# EAGLE design M709X (EAGLE 6.6.0)
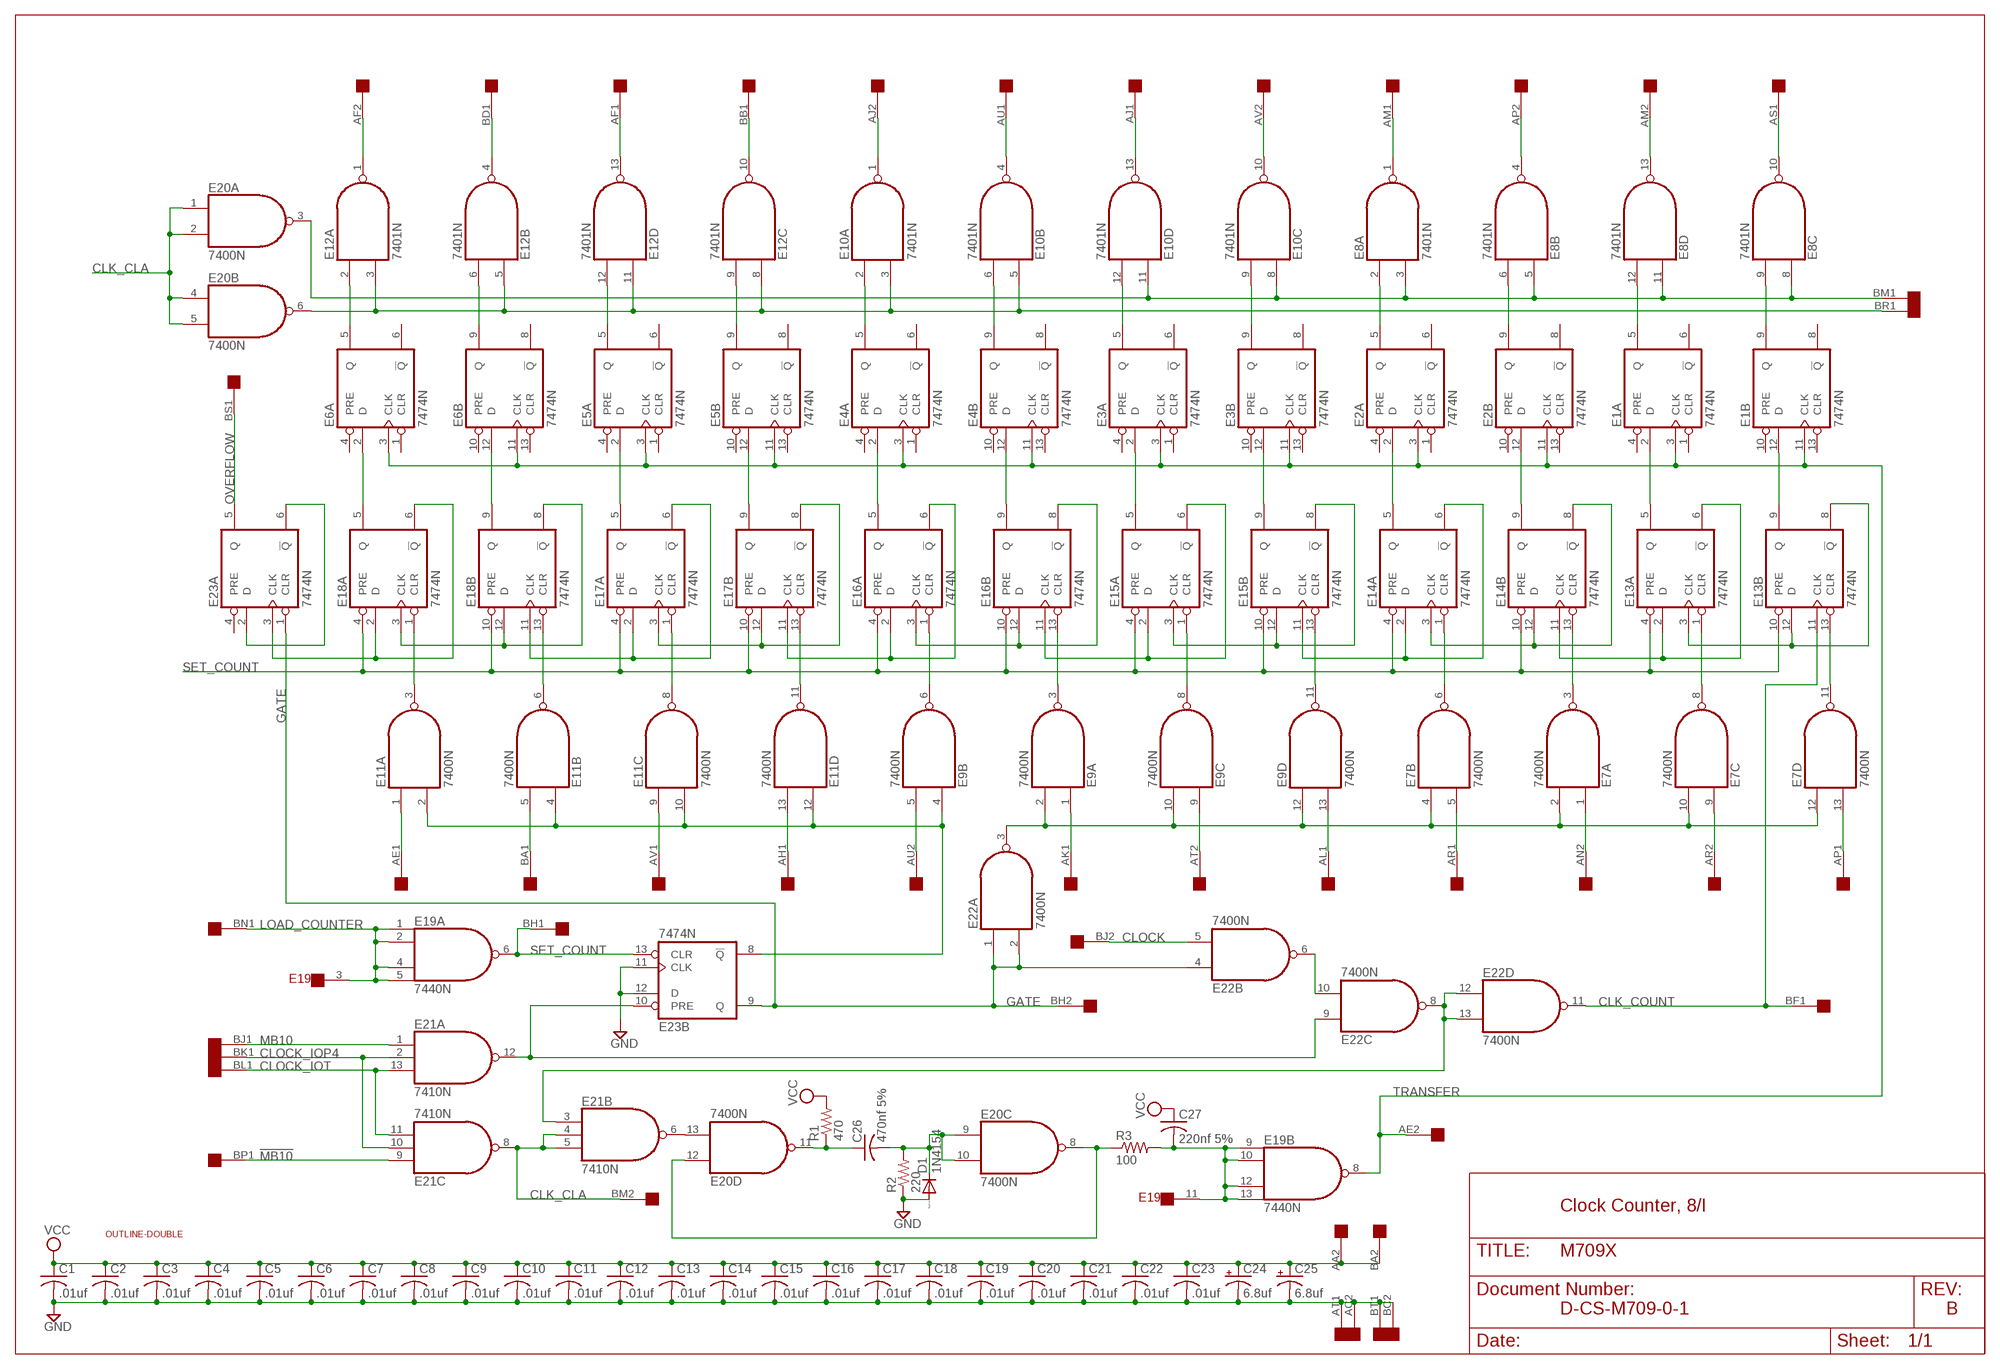
[diagram p0: schematic, sheet 1]

## Parts
C1  .01uf  C-US075-032X103  [C075-032X103]
C2  .01uf  C-US075-032X103  [C075-032X103]
C3  .01uf  C-US075-032X103  [C075-032X103]
C4  .01uf  C-US075-032X103  [C075-032X103]
C5  .01uf  C-US075-032X103  [C075-032X103]
C6  .01uf  C-US075-032X103  [C075-032X103]
C7  .01uf  C-US075-032X103  [C075-032X103]
C8  .01uf  C-US075-032X103  [C075-032X103]
C9  .01uf  C-US075-032X103  [C075-032X103]
C10  .01uf  C-US075-032X103  [C075-032X103]
C11  .01uf  C-US075-032X103  [C075-032X103]
C12  .01uf  C-US075-032X103  [C075-032X103]
C13  .01uf  C-US075-032X103  [C075-032X103]
C14  .01uf  C-US075-032X103  [C075-032X103]
C15  .01uf  C-US075-032X103  [C075-032X103]
C16  .01uf  C-US075-032X103  [C075-032X103]
C17  .01uf  C-US075-032X103  [C075-032X103]
C18  .01uf  C-US075-032X103  [C075-032X103]
C19  .01uf  C-US075-032X103  [C075-032X103]
C20  .01uf  C-US075-032X103  [C075-032X103]
C21  .01uf  C-US075-032X103  [C075-032X103]
C22  .01uf  C-US075-032X103  [C075-032X103]
C23  .01uf  C-US075-032X103  [C075-032X103]
C24  6.8uf  CPOL-USE15-5AXIAL  [E15-5]
C25  6.8uf  CPOL-USE15-5AXIAL  [E15-5]
C26  470nf 5%  C-US075-032X103  [C075-032X103]
C27  220nf 5%  C-US075-032X103  [C075-032X103]
D1  1N4154  DIODE-SOD61B  [SOD61B]
E1  7474N  74S74N  [DIL14]
E2  7474N  74S74N  [DIL14]
E3  7474N  74S74N  [DIL14]
E4  7474N  74S74N  [DIL14]
E5  7474N  74S74N  [DIL14]
E6  7474N  74S74N  [DIL14]
E7  7400N  [DIL14]
E8  7401N  74LS01N  [DIL14]
E9  7400N  [DIL14]
E10  7401N  74LS01N  [DIL14]
E11  7400N  [DIL14]
E12  7401N  74LS01N  [DIL14]
E13  7474N  74S74N  [DIL14]
E14  7474N  74S74N  [DIL14]
E15  7474N  74S74N  [DIL14]
E16  7474N  74S74N  [DIL14]
E17  7474N  74S74N  [DIL14]
E18  7474N  74S74N  [DIL14]
E19  7440N  74S40N  [DIL14]
E20  7400N  [DIL14]
E21  7410N  [DIL14]
E22  7400N  [DIL14]
E23  7474N  74S74N  [DIL14]
R1  470  R-US_0207/15  [0207/15]
R2  220  R-US_0207/15  [0207/15]
R3  100  R-US_0207/15  [0207/15]
U$1  OUTLINE-DOUBLE  [DOUBLE]
U$2  DOUBLE  [EDGE-CON4]

## Nets
!MB10: E21.9(C:I0) U$2.BP1
CLK_CLA: E20.1(A:I0) E20.2(A:I1) E20.4(B:I0) E20.5(B:I1) E21.4(B:I1) E21.5(B:I2) E21.8(C:O) U$2.BM2
CLK_COUNT: E13.11(B:CLK) E22.11(D:O) U$2.BF1
CLOCK: E22.5(B:I1) U$2.BJ2
CLOCK_IOP4: E21.2(A:I1) E21.10(C:I1) U$2.BK1
CLOCK_IOT: E21.11(C:I2) E21.13(A:I2) U$2.BL1
GATE: E22.1(A:I0) E22.2(A:I1) E22.4(B:I0) E23.1(A:CLR) E23.9(B:Q) U$2.BH2
GND [Supply]: C1.2 C2.2 C3.2 C4.2 C5.2 C6.2 C7.2 C8.2 C9.2 C10.2 C11.2 C12.2 C13.2 C14.2 C15.2 C16.2 C17.2 C18.2 C19.2 C20.2 C21.2 C22.2 C23.2 C24.- C25.- D1.A E23.11(B:CLK) E23.12(B:D) R2.1 U$2.AC2 U$2.AT1 U$2.BC2 U$2.BT1
LOAD_COUNTER: E19.1(A:I0) E19.2(A:I1) E19.3(3:NC) E19.4(A:I2) E19.5(A:I3) U$2.BN1
MB10: E21.1(A:I0) U$2.BJ1
N$1: E1.9(B:Q) E8.9(C:I1)
N$2: E1.5(A:Q) E8.12(D:I1)
N$3: E2.9(B:Q) E8.6(B:I1)
N$4: E2.5(A:Q) E8.2(A:I0)
N$5: E6.5(A:Q) E12.2(A:I0)
N$6: E3.9(B:Q) E10.9(C:I1)
N$7: E3.5(A:Q) E10.12(D:I1)
N$8: E4.5(A:Q) E10.2(A:I0)
N$9: E4.9(B:Q) E10.6(B:I1)
N$10: E5.5(A:Q) E12.12(D:I1)
N$11: E5.9(B:Q) E12.9(C:I1)
N$12: E6.9(B:Q) E12.6(B:I1)
N$13: E10.3(A:I1) E10.5(B:I0) E12.3(A:I1) E12.5(B:I0) E12.8(C:I0) E12.11(D:I0) E20.6(B:O) U$2.BR1
N$14: E8.1(A:O) U$2.AM1
N$15: E8.4(B:O) U$2.AP2
N$16: E8.13(D:O) U$2.AM2
N$17: E8.10(C:O) U$2.AS1
N$18: E10.13(D:O) U$2.AJ1
N$19: E10.4(B:O) U$2.AU1
N$20: E10.1(A:O) U$2.AJ2
N$21: E10.10(C:O) U$2.AV2
N$22: E12.1(A:O) U$2.AF2
N$23: E12.4(B:O) U$2.BD1
N$24: E12.13(D:O) U$2.AF1
N$25: E12.10(C:O) U$2.BB1
N$27: E8.3(A:I1) E8.5(B:I0) E8.8(C:I0) E8.11(D:I0) E10.8(C:I0) E10.11(D:I0) E20.3(A:O) U$2.BM1
N$28: E6.2(A:D) E18.5(A:Q)
N$29: E6.12(B:D) E18.9(B:Q)
N$30: E5.2(A:D) E17.5(A:Q)
N$31: E5.12(B:D) E17.9(B:Q)
N$32: E4.2(A:D) E16.5(A:Q)
N$33: E4.12(B:D) E16.9(B:Q)
N$34: E3.2(A:D) E15.5(A:Q)
N$35: E3.12(B:D) E15.9(B:Q)
N$36: E2.2(A:D) E14.5(A:Q)
N$37: E2.12(B:D) E14.9(B:Q)
N$38: E1.2(A:D) E13.5(A:Q)
N$39: E1.12(B:D) E13.9(B:Q)
N$40: E13.3(A:CLK) E13.8(B:!Q) E13.12(B:D)
N$41: E13.2(A:D) E13.6(A:!Q) E14.11(B:CLK)
N$42: E14.3(A:CLK) E14.8(B:!Q) E14.12(B:D)
N$43: E14.2(A:D) E14.6(A:!Q) E15.11(B:CLK)
N$44: E15.3(A:CLK) E15.8(B:!Q) E15.12(B:D)
N$45: E15.2(A:D) E15.6(A:!Q) E16.11(B:CLK)
N$46: E16.3(A:CLK) E16.8(B:!Q) E16.12(B:D)
N$47: E16.2(A:D) E16.6(A:!Q) E17.11(B:CLK)
N$48: E17.3(A:CLK) E17.8(B:!Q) E17.12(B:D)
N$49: E17.2(A:D) E17.6(A:!Q) E18.11(B:CLK)
N$50: E18.3(A:CLK) E18.8(B:!Q) E18.12(B:D)
N$51: E18.2(A:D) E18.6(A:!Q) E23.3(A:CLK)
N$52: E23.2(A:D) E23.6(A:!Q)
N$53: E7.6(B:O) E14.1(A:CLR)
N$54: E7.3(A:O) E14.13(B:CLR)
N$55: E7.8(C:O) E13.1(A:CLR)
N$56: E7.11(D:O) E13.13(B:CLR)
N$57: E7.2(A:I1) E7.4(B:I0) E7.10(C:I1) E7.12(D:I0) E9.2(A:I1) E9.10(C:I1) E9.12(D:I0) E22.3(A:O)
N$58: E9.4(B:I0) E11.2(A:I1) E11.4(B:I0) E11.10(C:I1) E11.12(D:I0) E23.8(B:!Q)
N$59: E22.6(B:O) E22.10(C:I1)
N$60: E7.13(D:I1) U$2.AP1
N$61: E9.6(B:O) E16.1(A:CLR)
N$62: E9.3(A:O) E16.13(B:CLR)
N$63: E9.8(C:O) E15.1(A:CLR)
N$64: E9.11(D:O) E15.13(B:CLR)
N$65: E11.11(D:O) E17.13(B:CLR)
N$66: E11.8(C:O) E17.1(A:CLR)
N$67: E11.6(B:O) E18.13(B:CLR)
N$68: E11.3(A:O) E18.1(A:CLR)
N$69: E7.9(C:I0) U$2.AR2
N$70: E7.1(A:I0) U$2.AN2
N$71: E7.5(B:I1) U$2.AR1
N$72: E9.13(D:I1) U$2.AL1
N$73: E9.1(A:I0) U$2.AK1
N$74: E9.9(C:I0) U$2.AT2
N$75: E11.9(C:I0) U$2.AV1
N$76: E11.13(D:I1) U$2.AH1
N$77: E9.5(B:I1) U$2.AU2
N$78: E11.1(A:I0) U$2.AE1
N$79: E11.5(B:I1) U$2.BA1
N$81: E21.12(A:O) E22.9(C:I0) E23.10(B:PRE)
N$83: E21.3(B:I0) E22.8(C:O) E22.12(D:I0) E22.13(D:I1)
N$84: C26.2 D1.C E20.9(C:I0) E20.10(C:I1) R2.2
N$85: E20.13(D:I1) E21.6(B:O)
N$86: C27.2 E19.9(B:I0) E19.10(B:I1) E19.11(11:NC) E19.12(B:I2) E19.13(B:I3) R3.2
N$87: C26.1 E20.11(D:O) R1.1
N$89: E20.8(C:O) E20.12(D:I0) R3.1
OVERFLOW: E23.5(A:Q) U$2.BS1
SET_COUNT: E13.4(A:PRE) E13.10(B:PRE) E14.4(A:PRE) E14.10(B:PRE) E15.4(A:PRE) E15.10(B:PRE) E16.4(A:PRE) E16.10(B:PRE) E17.4(A:PRE) E17.10(B:PRE) E18.4(A:PRE) E18.10(B:PRE) E19.6(A:O) E23.13(B:CLR) U$2.BH1
TRANSFER: E1.3(A:CLK) E1.11(B:CLK) E2.3(A:CLK) E2.11(B:CLK) E3.3(A:CLK) E3.11(B:CLK) E4.3(A:CLK) E4.11(B:CLK) E5.3(A:CLK) E5.11(B:CLK) E6.3(A:CLK) E6.11(B:CLK) E19.8(B:O) U$2.AE2
VCC [Supply]: C1.1 C2.1 C3.1 C4.1 C5.1 C6.1 C7.1 C8.1 C9.1 C10.1 C11.1 C12.1 C13.1 C14.1 C15.1 C16.1 C17.1 C18.1 C19.1 C20.1 C21.1 C22.1 C23.1 C24.+ C25.+ C27.1 R1.2 U$2.AA2 U$2.BA2
Unconnected: E1.1(A:CLR) E1.4(A:PRE) E1.6(A:!Q) E1.8(B:!Q) E1.10(B:PRE) E1.13(B:CLR) E2.1(A:CLR) E2.4(A:PRE) E2.6(A:!Q) E2.8(B:!Q) E2.10(B:PRE) E2.13(B:CLR) E3.1(A:CLR) E3.4(A:PRE) E3.6(A:!Q) E3.8(B:!Q) E3.10(B:PRE) E3.13(B:CLR) E4.1(A:CLR) E4.4(A:PRE) E4.6(A:!Q) E4.8(B:!Q) E4.10(B:PRE) E4.13(B:CLR) E5.1(A:CLR) E5.4(A:PRE) E5.6(A:!Q) E5.8(B:!Q) E5.10(B:PRE) E5.13(B:CLR) E6.1(A:CLR) E6.4(A:PRE) E6.6(A:!Q) E6.8(B:!Q) E6.10(B:PRE) E6.13(B:CLR) E23.4(A:PRE) U$2.AA1 U$2.AB1 U$2.AB2 U$2.AC1 U$2.AD1 U$2.AD2 U$2.AH2 U$2.AK2 U$2.AL2 U$2.AN1 U$2.AS2 U$2.BB2 U$2.BC1 U$2.BD2 U$2.BE1 U$2.BE2 U$2.BF2 U$2.BK2 U$2.BL2 U$2.BN2 U$2.BP2 U$2.BR2 U$2.BS2 U$2.BT2 U$2.BU1 U$2.BU2 U$2.BV1 U$2.BV2

## Notes on the sheet
- Clock Counter, 8/I
- D-CS-M709-0-1 | B

## Power pins joined to a net without a drawn wire
GND: E1.7(P:GND) E2.7(P:GND) E3.7(P:GND) E4.7(P:GND) E5.7(P:GND) E6.7(P:GND) E7.7(P:GND) E8.7(P:GND) E9.7(P:GND) E10.7(P:GND) E11.7(P:GND) E12.7(P:GND) E13.7(P:GND) E14.7(P:GND) E15.7(P:GND) E16.7(P:GND) E17.7(P:GND) E18.7(P:GND) E19.7(P:GND) E20.7(P:GND) E21.7(P:GND) E22.7(P:GND) E23.7(P:GND)
VCC: E1.14(P:VCC) E2.14(P:VCC) E3.14(P:VCC) E4.14(P:VCC) E5.14(P:VCC) E6.14(P:VCC) E7.14(P:VCC) E8.14(P:VCC) E9.14(P:VCC) E10.14(P:VCC) E11.14(P:VCC) E12.14(P:VCC) E13.14(P:VCC) E14.14(P:VCC) E15.14(P:VCC) E16.14(P:VCC) E17.14(P:VCC) E18.14(P:VCC) E19.14(P:VCC) E20.14(P:VCC) E21.14(P:VCC) E22.14(P:VCC) E23.14(P:VCC)

## Library data of the parts
C1-C23 C26 C27 = rcl:C-US: CAPACITOR, American symbol
C24 C25 = dec-con:CPOL-USE15-5AXIAL: 0.6" veresion of an electrolytic
D1 = diode:DIODE-: DIODE
E1-E6 E13-E18 E23 = 74xx-us:74*74: Dual D type positive edge triggered FLIP FLOP, preset and clear
E7 E9 E11 E20 E22 = 74xx-us:74*00: Quad 2-input NAND gate
E8 E10 E12 = 74xx-us:74*01: Quad 2-input NAND gate, open collector
E19 = dec-con:74*40: Dual 4-input NAND gate
E21 = 74xx-us:74*10: Triple 3-input NAND gate
R1-R3 = rcl:R-US_: RESISTOR, American symbol
U$1 = dec-con:OUTLINE-*: Board outlines for DEC boards.
U$2 = dec-con:DOUBLE: Double-Height DEC board

## Net classes
0 default: width 0.406 mm
1 Supply: width 0.813 mm

## Board
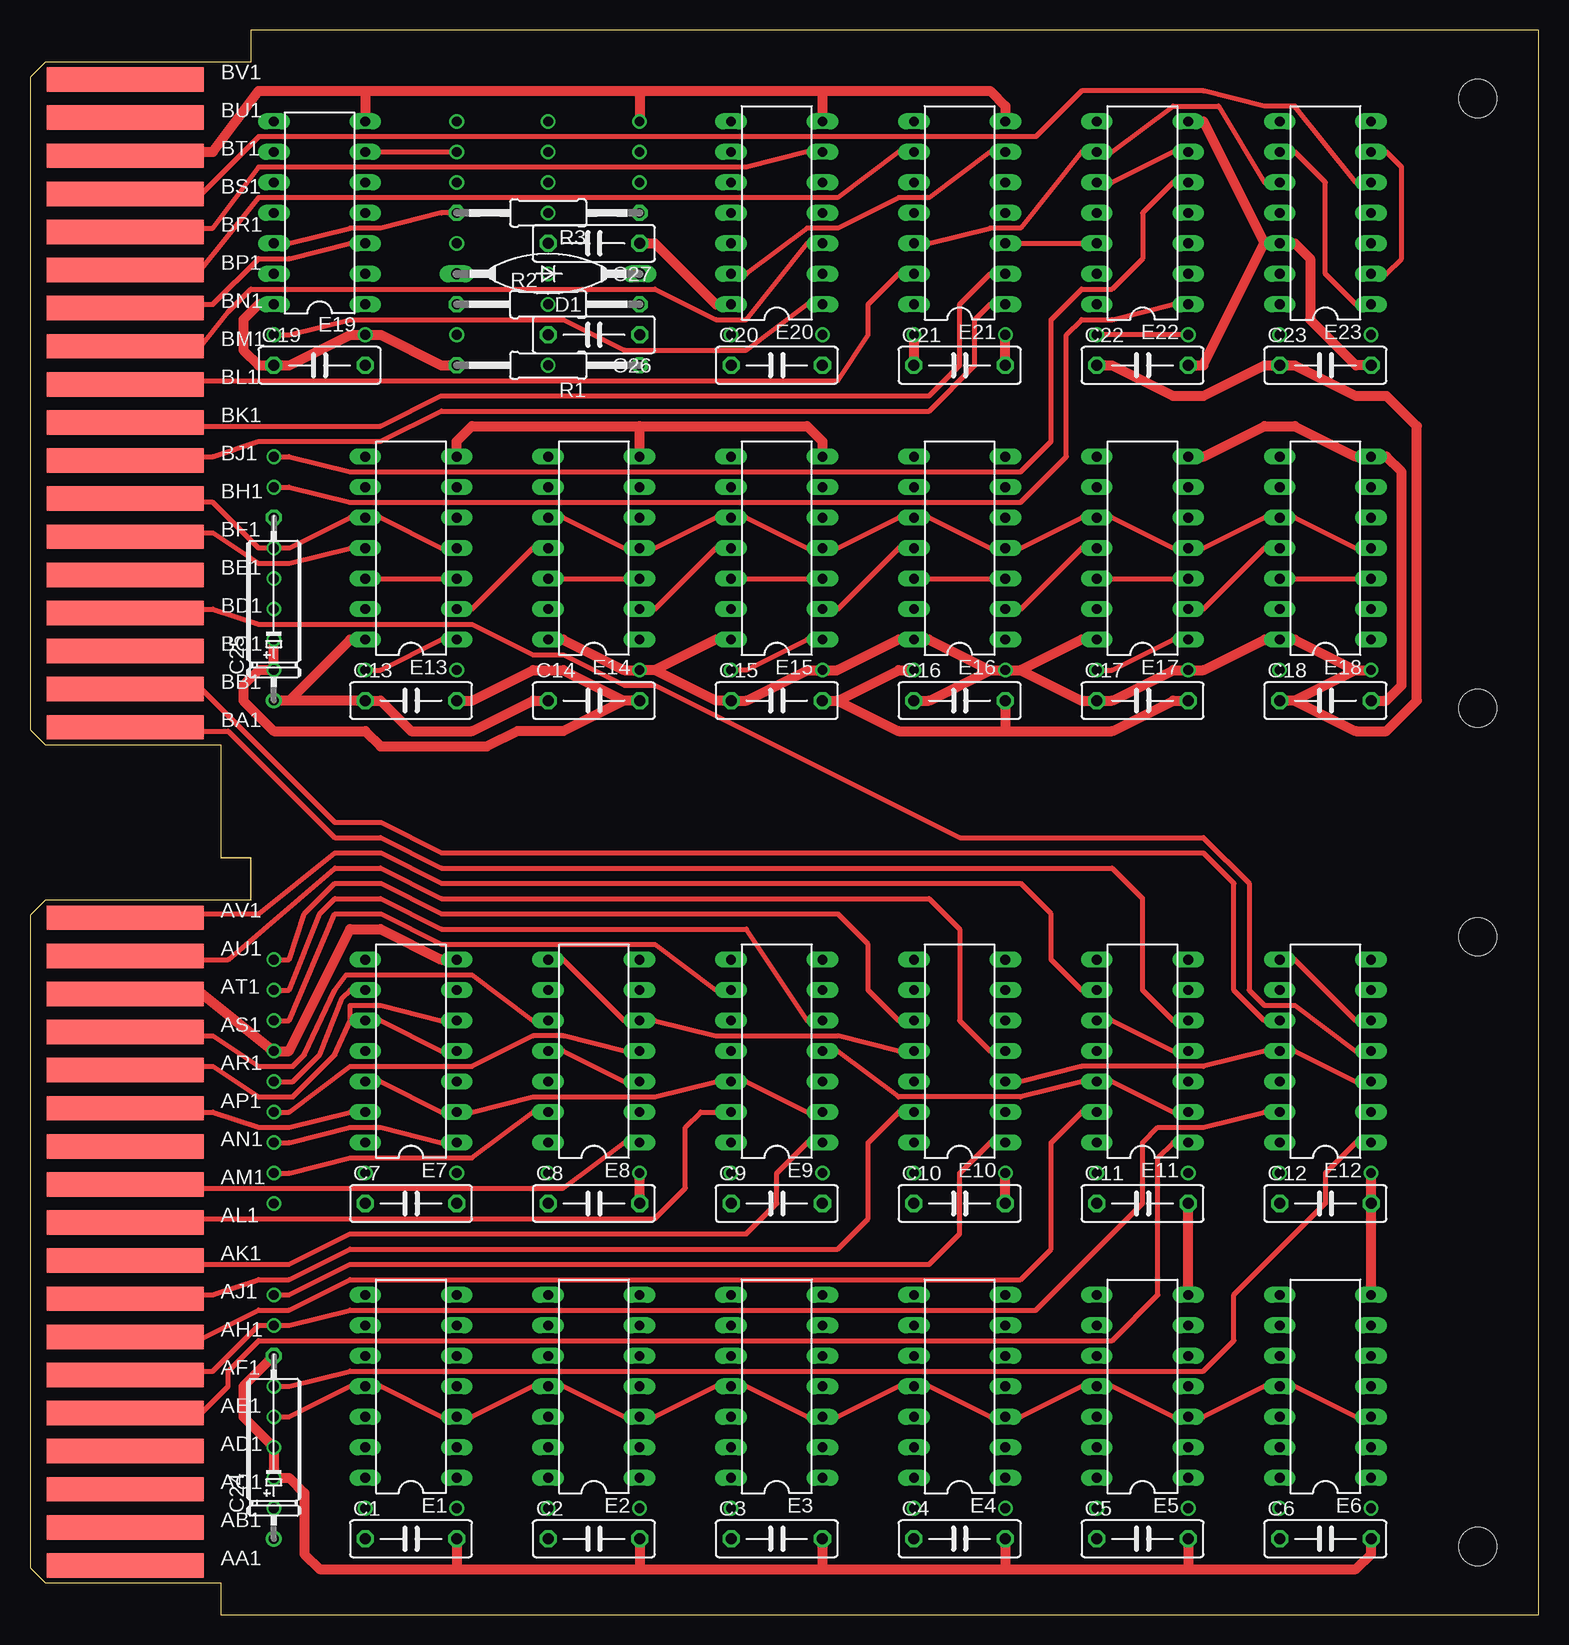
[diagram p1: board, top side]
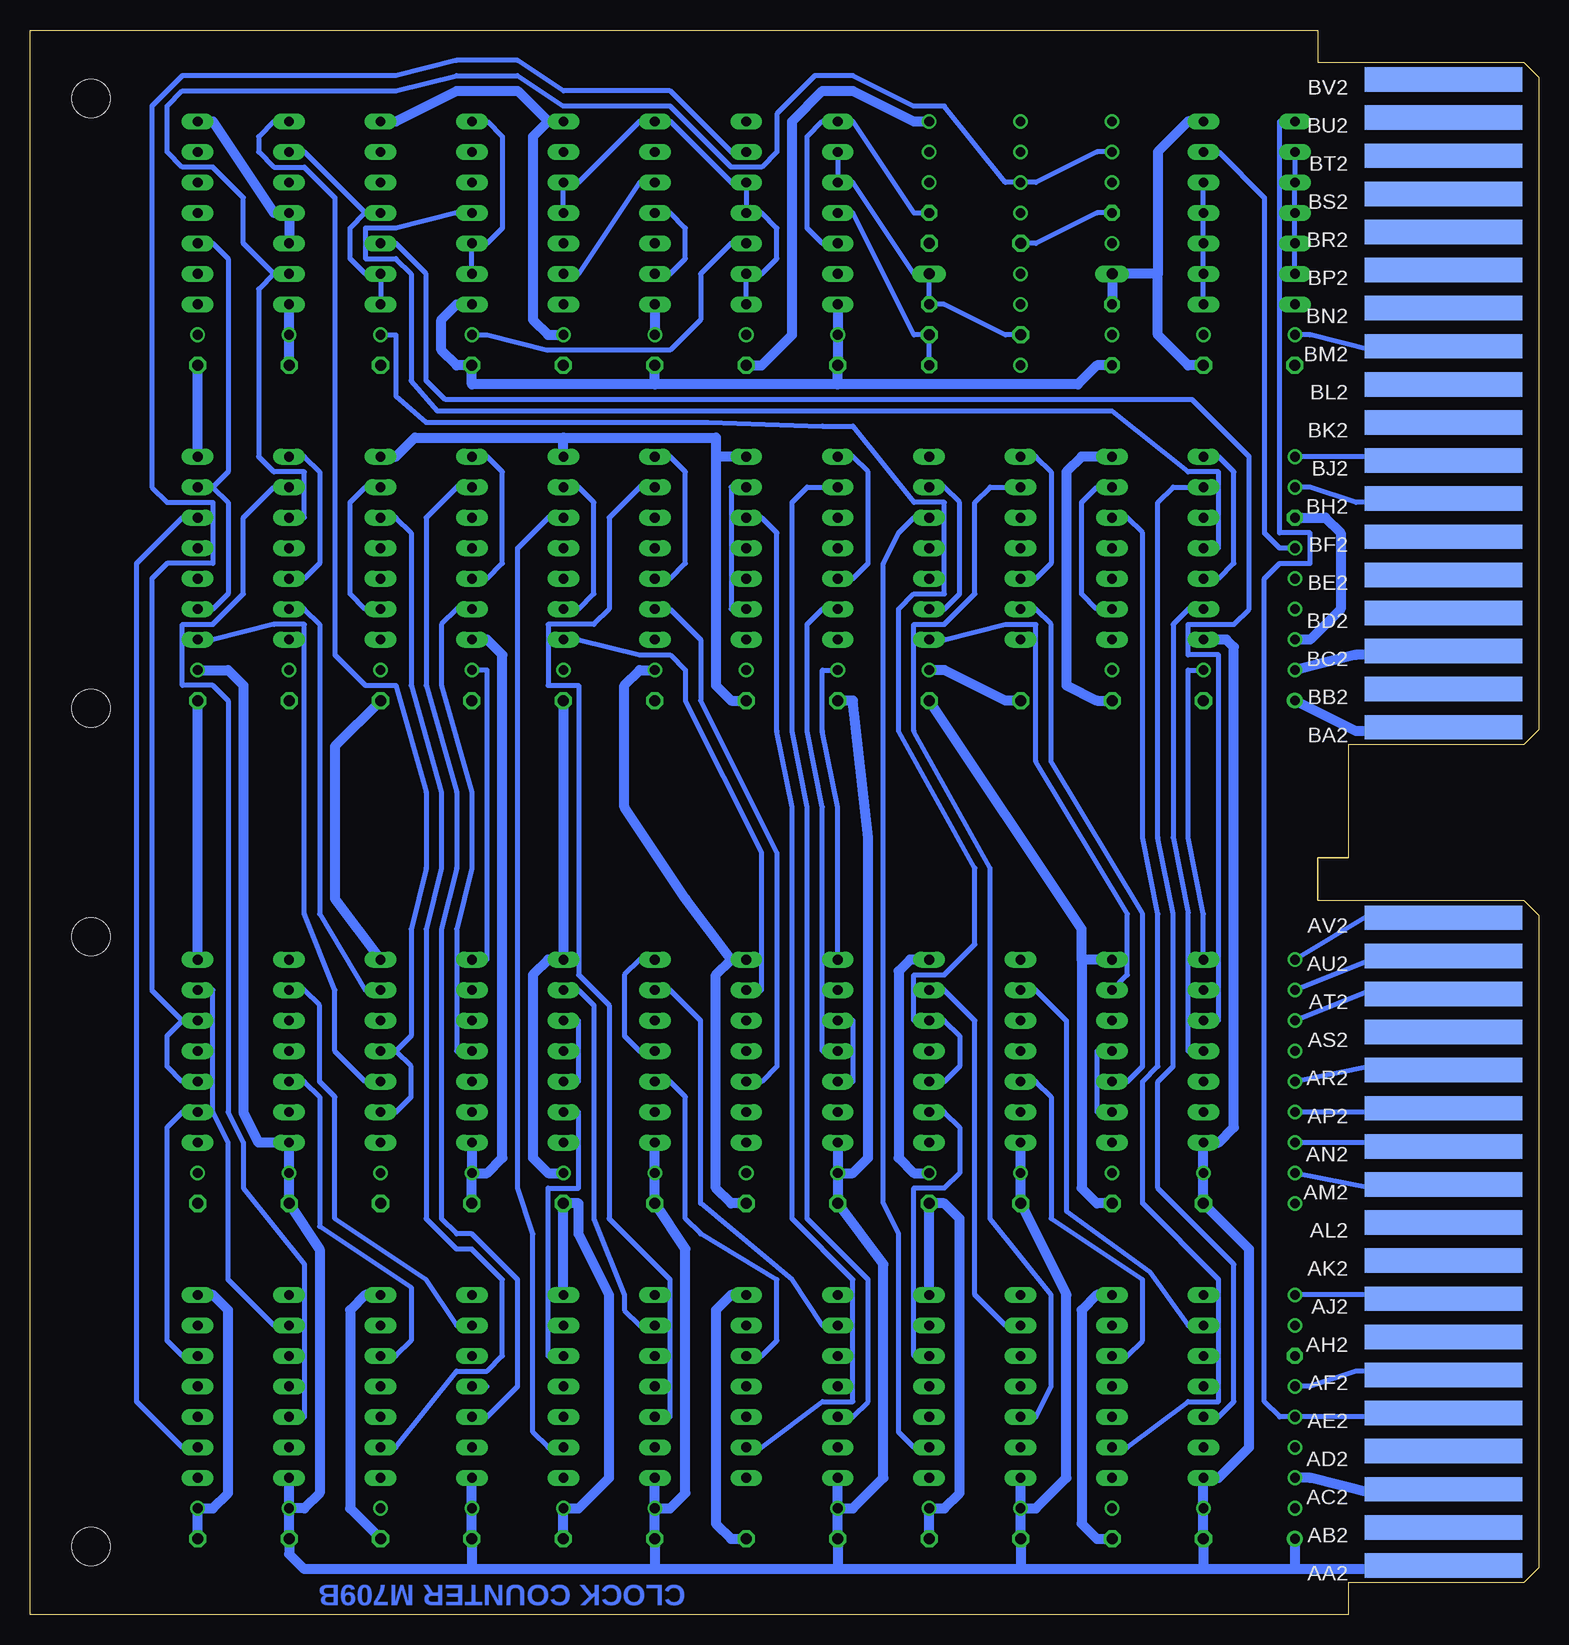
[diagram p2: board, bottom side, seen from below]

Size 125.73 x 132.08 mm. Coordinates in mm from the lower left corner, seen from the top.
Copper layers (1+16): Top 0.035mm / dielectric 1.5mm / Bottom 0.035mm
Design rules "16mils": minimum track width 16mil, minimum drill 32mil, track to track 15mil, track to pad 10mil, pad to pad 10mil, via to via 10mil, smd to smd 10mil, copper to edge 13mil, drill to drill 10mil, minimum pad ring 10mil, minimum via ring 8mil, stop-mask expansion 0mil, vias tented up to drill 0mil, thermal gap 10mil

### Footprints (pad centres in the part's own frame; a part is rotated, then mirrored left to right if it is on the bottom)
C075-032X103 = drill 0.914 octagon: 1 -3.81,0; 2 3.81,0
E15-5 = drill 0.813: + -7.62,0 | drill 0.813 octagon: - 7.62,0
SOD61B = drill 0.914 long: A 7.62,0; C -7.62,0
DIL14 = drill 0.813 long: 1 -7.62,-3.81; 2 -5.08,-3.81; 3 -2.54,-3.81; 4 0,-3.81; 5 2.54,-3.81; 6 5.08,-3.81; 7 7.62,-3.81; 8 7.62,3.81; 9 5.08,3.81; 10 2.54,3.81; 11 0,3.81; 12 -2.54,3.81; 13 -5.08,3.81; 14 -7.62,3.81
0207/15 = drill 0.813 octagon: 1 -7.62,0; 2 7.62,0
DOUBLE = hole 3.175: 120.65,56.515; 120.65,5.715; 120.65,75.565; 120.65,126.365
EDGE-CON4 = smd 13.106 x 2.032: AA1 7.938,4.128; AB1 7.938,7.303; AC1 7.938,10.477; AD1 7.938,13.652; AE1 7.938,16.828; AF1 7.938,20.003; AH1 7.938,23.177; AJ1 7.938,26.352; AK1 7.938,29.527; AL1 7.938,32.703; AM1 7.938,35.877; AN1 7.938,39.053; AP1 7.938,42.227; AR1 7.938,45.403; AS1 7.938,48.578; AT1 7.938,51.752; AU1 7.938,54.928; AV1 7.938,58.102; BA1 7.938,73.978; BB1 7.938,77.153; BC1 7.938,80.328; BD1 7.938,83.502; BE1 7.938,86.677; BF1 7.938,89.853; BH1 7.938,93.028; BJ1 7.938,96.203; BK1 7.938,99.377; BL1 7.938,102.552; BM1 7.938,105.728; BN1 7.938,108.903; BP1 7.938,112.078; BR1 7.938,115.252; BS1 7.938,118.427; BT1 7.938,121.603; BU1 7.938,124.778; BV1 7.938,127.953 | smd 13.106 x 2.032 bottom: AA2 7.938,4.128; AB2 7.938,7.303; AC2 7.938,10.477; AD2 7.938,13.652; AE2 7.938,16.828; AF2 7.938,20.003; AH2 7.938,23.177; AJ2 7.938,26.352; AK2 7.938,29.527; AL2 7.938,32.703; AM2 7.938,35.877; AN2 7.938,39.053; AP2 7.938,42.227; AR2 7.938,45.403; AS2 7.938,48.578; AT2 7.938,51.752; AU2 7.938,54.928; AV2 7.938,58.102; BA2 7.938,73.978; BB2 7.938,77.153; BC2 7.938,80.328; BD2 7.938,83.502; BE2 7.938,86.677; BF2 7.938,89.853; BH2 7.938,93.028; BJ2 7.938,96.203; BK2 7.938,99.377; BL2 7.938,102.552; BM2 7.938,105.728; BN2 7.938,108.903; BP2 7.938,112.078; BR2 7.938,115.252; BS2 7.938,118.427; BT2 7.938,121.603; BU2 7.938,124.778; BV2 7.938,127.953

### Placement (x,y rotation side)
C1  31.75,6.35 0 top
C2  46.99,6.35 0 top
C3  62.23,6.35 0 top
C4  77.47,6.35 0 top
C5  92.71,6.35 0 top
C6  107.95,6.35 0 top
C7  31.75,34.29 0 top
C8  46.99,34.29 0 top
C9  62.23,34.29 0 top
C10  77.47,34.29 0 top
C11  92.71,34.29 0 top
C12  107.95,34.29 0 top
C13  31.75,76.2 0 top
C14  46.99,76.2 0 top
C15  62.23,76.2 0 top
C16  77.47,76.2 0 top
C17  92.71,76.2 0 top
C18  107.95,76.2 0 top
C19  24.13,104.14 0 top
C20  62.23,104.14 0 top
C21  77.47,104.14 0 top
C22  92.71,104.14 0 top
C23  107.95,104.14 0 top
C24  20.32,13.97 90 top
C25  20.32,83.82 90 top
C26  46.99,106.68 180 top
C27  46.99,114.3 180 top
D1  43.18,111.76 180 top
E1  31.75,19.05 90 top
E2  46.99,19.05 90 top
E3  62.23,19.05 90 top
E4  77.47,19.05 90 top
E5  92.71,19.05 90 top
E6  107.95,19.05 90 top
E7  31.75,46.99 90 top
E8  46.99,46.99 90 top
E9  62.23,46.99 90 top
E10  77.47,46.99 90 top
E11  92.71,46.99 90 top
E12  107.95,46.99 90 top
E13  31.75,88.9 90 top
E14  46.99,88.9 90 top
E15  62.23,88.9 90 top
E16  77.47,88.9 90 top
E17  92.71,88.9 90 top
E18  107.95,88.9 90 top
E19  24.13,116.84 90 top
E20  62.23,116.84 90 top
E21  77.47,116.84 90 top
E22  92.71,116.84 90 top
E23  107.95,116.84 90 top
R1  43.18,104.14 180 top
R2  43.18,109.22 0 top
R3  43.18,116.84 180 top
U$1  0,0 0 top
U$2  0,0 0 top

### Tracks (layer width: path | path; a pad name or v marks a point on that pad's centre or on a via)
!MB10
  Top 0.406: U$2.BP1 8.89,111.76 13.97,111.76 19.05,118.11 67.31,118.11 72.39,121.92 E21.9
CLK_CLA  (via drill 0.81)
  Top 0.406: v20.32,106.68 21.59,106.68 26.67,107.95 44.45,107.95 49.53,105.41 59.69,105.41 64.77,109.22 E20.1
  Bottom 0.406: U$2.BM2 12.7,105.41 13.97,105.41 19.05,106.68 v20.32,106.68 | E20.1 E20.2 64.77,111.76 63.5,113.03 63.5,115.57 64.77,116.84 E20.4 E20.5 67.31,119.38 72.39,124.46 E21.8 74.93,124.46 80.01,119.38 E21.5 E21.4
CLK_COUNT
  Top 0.406: U$2.BF1 8.89,90.17 15.24,90.17 19.05,87.63 21.59,87.63 26.67,88.9 E13.11
  Bottom 0.406: E13.11 26.67,88.9 26.67,95.25 29.21,95.25 35.56,100.33 91.76,100.33 93.98,102.87 93.98,111.76 95.25,113.03 97.79,113.03 97.79,115.57 95.25,115.57 90.17,116.84 E22.11
CLOCK  (via drill 0.81)
  Top 0.406: v20.32,96.52 21.59,96.52 26.67,95.25 82.55,95.25 85.09,97.79 85.09,107.95 87.63,110.49 90.17,110.49 92.71,113.03 92.71,116.84 95.25,119.38 E22.5
  Bottom 0.406: U$2.BJ2 10.16,96.52 v20.32,96.52
CLOCK_IOP4
  Top 0.406: U$2.BK1 8.89,99.06 29.21,99.06 34.29,101.6 74.93,101.6 77.47,104.14 77.47,109.22 80.01,111.76 E21.2
  Bottom 0.406: E21.10 74.93,119.38 80.01,111.76 E21.2
CLOCK_IOT
  Top 0.406: U$2.BL1 8.89,102.87 67.31,102.87 69.85,106.68 69.85,109.22 72.39,111.76 E21.13
  Bottom 0.406: E21.13 72.39,111.76 71.12,113.03 71.12,115.57 72.39,116.84 E21.11
GATE  (via drill 0.81)
  Top 0.406: v20.32,93.98 21.59,93.98 26.67,92.71 82.55,92.71 86.36,96.52 86.36,106.68 87.63,107.95 90.17,107.95 95.25,109.22 E22.1 | E23.1 110.49,109.22 107.95,111.76 107.95,119.38 105.41,121.92 E23.9
  Bottom 0.406: E22.1 E22.2 97.79,111.76 99.06,113.03 99.06,115.57 97.79,116.84 | 97.79,116.84 E22.4 | E23.9 102.87,121.92 97.79,116.84 | U$2.BH2 8.89,92.71 15.24,92.71 19.05,93.98 v20.32,93.98
GND  (via drill 0.81)
  Top 0.813: 35.56,3.81 24.13,3.81 22.86,5.08 22.86,10.16 21.59,11.43 v20.32,11.43 v20.32,13.97 17.78,16.51 17.78,19.05 C24.- | 35.56,3.81 50.8,3.81 | 50.8,3.81 66.04,3.81 | 66.04,3.81 81.28,3.81 | 81.28,3.81 96.52,3.81 | 96.52,3.81 110.49,3.81 111.76,5.08 C6.2 | C5.2 96.52,3.81 | C4.2 81.28,3.81 | C3.2 66.04,3.81 | C2.2 50.8,3.81 | C1.2 35.56,3.81 | U$2.AT1 10.16,52.07 13.97,52.07 v20.32,46.99 21.59,46.99 26.67,57.15 29.21,57.15 34.29,54.61 E7.7 | E6.7 C12.2 v111.76,36.83 | U$2.BT1 8.89,121.92 15.24,121.92 19.05,127 27.94,127 | 27.94,127 E19.7 | 27.94,127 50.8,127 | 50.8,127 v50.8,124.46 | 50.8,127 66.04,127 | 66.04,127 E20.7 | 66.04,127 80.01,127 81.28,125.73 E21.7 | C14.2 49.53,76.2 | 49.53,76.2 44.45,73.66 40.64,73.66 38.1,72.39 29.21,72.39 27.94,73.66 20.32,73.66 17.78,76.2 17.78,77.47 19.05,78.74 v20.32,78.74 v20.32,81.28 | C13.2 36.83,76.2 41.91,78.74 44.45,78.74 49.53,76.2 | C15.2 67.31,76.2 | 67.31,76.2 72.39,78.74 v73.66,78.74 | 67.31,76.2 72.39,73.66 81.28,73.66 | 81.28,73.66 90.17,73.66 95.25,76.2 C17.2 | C16.2 81.28,73.66 | C18.2 113.03,76.2 114.3,77.47 114.3,95.25 113.03,96.52 E18.7 110.49,96.52 105.41,99.06 102.87,99.06 97.79,96.52 E17.7 | C22.2 97.79,104.14 102.87,114.3 | 102.87,114.3 E23.12 105.41,114.3 106.68,113.03 106.68,107.95 110.49,104.14 C23.2 | E22.7 97.79,124.46 102.87,114.3 | E5.7 C11.2 | E13.7 35.56,97.79 36.83,99.06 50.8,99.06 | 50.8,99.06 64.77,99.06 66.04,97.79 E15.7 | E14.7 50.8,99.06 | C21.2 v81.28,106.68 | C8.2 v50.8,36.83 | C10.2 v81.28,36.83
  Bottom 0.813: C6.2 v111.76,8.89 110.49,8.89 109.22,10.16 109.22,25.4 110.49,26.67 E6.7 | U$2.AC2 8.89,10.16 13.97,10.16 19.05,11.43 v20.32,11.43 | E1.7 36.83,26.67 38.1,25.4 38.1,7.62 36.83,6.35 C1.2 | C2.2 v50.8,8.89 49.53,8.89 48.26,10.16 48.26,33.02 49.53,34.29 C8.2 E2.7 | C7.2 36.83,34.29 38.1,35.56 38.1,54.61 | E7.7 38.1,54.61 | 38.1,54.61 38.1,57.15 C14.2 | C20.2 64.77,104.14 62.23,106.68 62.23,124.46 59.69,127 57.15,127 52.07,124.46 v50.8,124.46 | R2.1 D1.A 31.75,111.76 | E19.7 29.21,124.46 31.75,121.92 31.75,111.76 | C19.2 29.21,104.14 31.75,106.68 31.75,111.76 | U$2.BC2 8.89,80.01 15.24,80.01 v20.32,78.74 | C25.- 17.78,91.44 16.51,90.17 16.51,83.82 19.05,81.28 v20.32,81.28 | E21.7 82.55,124.46 | 82.55,124.46 83.82,123.19 83.82,107.95 82.55,106.68 v81.28,106.68 | E22.7 95.25,124.46 90.17,127 85.09,127 82.55,124.46 | E23.12 E23.11 105.41,116.84 110.49,124.46 E23.7 | C17.2 100.33,72.39 100.33,59.69 E11.7 | E18.7 C23.2 | E12.7 C18.2 | E5.7 97.79,26.67 99.06,25.4 99.06,8.89 C5.2 | C4.2 v81.28,8.89 80.01,8.89 77.47,11.43 77.47,26.67 80.01,31.75 80.01,34.29 C10.2 E4.7 | C16.2 E10.7 82.55,54.61 83.82,53.34 83.82,38.1 82.55,36.83 v81.28,36.83 | E3.7 67.31,26.67 68.58,25.4 68.58,7.62 67.31,6.35 C3.2 | C9.2 67.31,34.29 68.58,35.56 68.58,53.34 67.31,54.61 | 67.31,54.61 E9.7 | E17.7 95.25,96.52 93.66,98.11 81.28,98.11 | 81.28,98.11 68.58,98.11 68.58,96.52 | 68.58,96.52 68.58,77.47 67.31,76.2 C15.2 | E15.7 68.58,96.52 | E8.7 52.39,54.61 53.34,53.66 53.34,38.1 52.07,36.83 v50.8,36.83 | E13.7 38.1,96.52 39.37,95.25 39.37,77.47 36.83,76.2 C13.2 | 67.31,54.61 71.12,59.69 76.2,67.31 76.2,77.47 74.93,78.74 v73.66,78.74
  Bottom 0.813: E16.7 81.28,98.11
LOAD_COUNTER
  Top 0.406: U$2.BN1 8.89,109.22 15.24,109.22 19.05,113.03 21.59,113.03 26.67,114.3 E19.3
  Bottom 0.406: E19.1 E19.2 E19.3 E19.4 E19.5
MB10
  Top 0.406: U$2.BJ1 8.89,96.52 15.24,96.52 19.05,97.79 29.21,97.79 34.29,100.33 74.93,100.33 78.74,104.14 78.74,107.95 80.01,109.22 E21.1
N$1
  Bottom 0.406: E1.9 29.21,24.13 32.39,28.57 39.37,33.66 39.37,49.53 41.91,52.07 E8.9
N$2
  Bottom 0.406: E1.5 34.29,21.59 33.02,22.86 33.02,27.94 40.64,33.02 40.64,43.18 41.91,44.45 E8.12
N$3
  Bottom 0.406: E2.9 44.45,24.13 46.99,26.67 46.99,49.53 49.53,52.07 E8.6
N$4
  Bottom 0.406: E2.5 52.07,21.59 52.07,35.56 49.53,35.56 48.26,36.83 48.26,40.64 49.53,41.91 E8.2
N$5
  Bottom 0.406: E12.2 113.03,41.91 114.3,40.64 114.3,22.86 113.03,21.59 E6.5
N$6
  Bottom 0.406: E3.9 59.69,24.13 62.23,27.94 69.85,34.29 69.85,49.53 72.39,52.07 E10.9
N$7
  Bottom 0.406: E3.5 64.77,21.59 63.5,22.86 63.5,27.94 69.85,31.75 71.12,33.02 71.12,43.18 72.39,44.45 E10.12
N$8
  Bottom 0.406: E4.5 82.55,21.59 82.55,35.56 80.01,35.56 80.01,41.91 E10.2
N$9
  Bottom 0.406: E10.6 80.01,52.07 78.74,50.8 78.74,33.02 76.2,26.67 76.2,25.4 74.93,24.13 E4.9
N$10
  Bottom 0.406: E12.12 102.87,44.45 101.6,43.18 101.6,32.38 93.98,27.3 93.98,22.86 95.25,21.59 E5.5
N$11
  Bottom 0.406: E5.9 90.17,24.13 92.71,27.94 100.33,33.02 100.33,43.18 101.6,44.45 101.6,50.8 102.87,52.07 E12.9
N$12
  Bottom 0.406: E6.9 105.41,24.13 109.22,27.94 109.22,39.37 110.49,41.91 110.49,52.07 E12.6
N$13
  Top 0.406: E12.8 105.41,54.61 110.49,49.53 E12.5 | E12.3 110.49,44.45 105.41,46.99 E12.11 102.87,46.99 97.79,45.72 87.63,45.72 82.55,44.45 E10.3 | U$2.BR1 8.89,115.57 15.24,115.57 19.05,120.65 59.69,120.65 64.77,121.92 E20.6
  Bottom 0.406: E12.3 113.03,44.45 114.3,45.72 114.3,48.26 113.03,49.53 | 113.03,49.53 E12.5 | E10.3 80.01,44.45 80.01,49.53 E10.5 | E20.6 67.31,121.92 72.39,127 81.28,127 85.09,129.54 90.17,129.54 95.25,128.27 113.03,128.27 115.57,125.73 115.57,93.98 114.3,92.71 110.49,92.71 110.49,87.63 114.3,87.63 115.57,86.36 115.57,52.07 113.03,49.53
N$14
  Top 0.406: U$2.AM1 11.43,35.56 44.45,35.56 49.53,39.37 E8.1
N$15  (via drill 0.81)
  Top 0.406: v20.32,41.91 21.59,41.91 26.67,45.72 36.83,45.72 41.91,48.26 44.45,48.26 49.53,46.99 E8.4
  Bottom 0.406: U$2.AP2 11.43,41.91 v20.32,41.91
N$16  (via drill 0.81)
  Top 0.406: v20.32,36.83 21.59,36.83 26.67,38.1 36.83,38.1 41.91,41.91 E8.13
  Bottom 0.406: U$2.AM2 8.89,35.56 13.97,35.56 v20.32,36.83
N$17
  Top 0.406: U$2.AS1 8.89,48.26 15.24,48.26 19.05,45.72 21.91,45.72 22.86,46.67 25.4,52.07 26.35,53.34 36.83,53.34 41.91,49.53 E8.10
N$18
  Top 0.406: U$2.AJ1 8.89,26.67 15.24,26.67 19.05,27.94 21.59,27.94 26.67,30.48 67.31,30.48 69.85,33.02 69.85,39.37 72.39,41.91 E10.13
N$19
  Top 0.406: U$2.AU1 8.89,54.61 16.51,54.61 25.4,62.23 29.21,62.23 34.29,59.69 74.93,59.69 77.47,57.15 77.47,49.53 80.01,46.99 E10.4
N$20  (via drill 0.81)
  Top 0.406: v20.32,26.67 21.59,26.67 26.67,29.21 74.93,29.21 77.47,31.75 77.47,36.83 80.01,39.37 E10.1
  Bottom 0.406: U$2.AJ2 10.16,26.67 v20.32,26.67
N$21  (via drill 0.81)
  Top 0.406: v20.32,54.61 21.59,54.61 22.86,58.42 25.4,60.96 29.21,60.96 34.29,58.42 67.31,58.42 69.85,55.88 69.85,52.07 72.39,49.53 E10.10
  Bottom 0.406: U$2.AV2 11.43,58.42 13.97,58.42 v20.32,54.61
N$22  (via drill 0.81)
  Top 0.406: v20.32,19.05 21.59,19.05 26.67,20.32 97.79,20.32 100.33,22.86 100.33,26.67 107.95,34.29 107.95,36.83 110.49,39.37 E12.1
  Bottom 0.406: U$2.AF2 10.16,20.32 15.24,20.32 19.05,19.05 v20.32,19.05
N$23
  Top 0.406: U$2.BD1 8.89,83.82 15.24,83.82 19.05,82.55 36.83,82.55 41.91,80.01 44.45,80.01 49.53,77.47 52.07,77.47 77.47,64.77 97.79,64.77 101.6,60.96 101.6,52.07 102.87,50.8 105.41,50.8 110.49,46.99 E12.4
N$24  (via drill 0.81)
  Top 0.406: U$2.AF1 8.89,20.32 15.24,20.32 19.05,24.13 v20.32,24.13 21.59,24.13 26.67,25.4 83.82,25.4 92.71,34.29 92.71,39.37 93.98,40.64 97.79,40.64 102.87,41.91 E12.13
N$25
  Top 0.406: U$2.BB1 8.89,77.47 13.97,77.47 25.4,66.04 29.21,66.04 34.29,63.5 97.79,63.5 100.33,60.96 100.33,52.07 102.87,49.53 E12.10
N$26  (via drill 0.81)
  other vias: 20.32,8.89
N$27  (via drill 0.81)
  Top 0.406: v96.52,106.68 v88.9,106.68 | E8.8 44.45,54.61 49.53,49.53 E8.5 52.07,49.53 57.15,48.26 67.31,48.26 72.39,46.99 E10.11 | E8.11 44.45,46.99 49.53,44.45 E8.3 | U$2.BM1 8.89,105.41 13.97,105.41 16.51,108.58 18.42,110.49 52.07,110.49 57.15,107.95 59.69,107.95 64.77,114.3 E20.3
  Bottom 0.406: E10.8 74.93,54.61 76.2,53.34 76.2,48.26 74.93,46.99 E10.11 | E8.3 49.53,44.45 48.26,45.72 48.26,48.26 49.53,49.53 E8.5 52.07,49.53 52.07,53.34 49.53,53.34 46.99,55.88 46.99,62.23 53.34,73.66 53.34,83.82 52.07,85.09 49.53,85.09 49.53,92.71 52.07,92.71 57.15,99.06 59.69,99.06 69.22,99.38 92.71,99.38 95.25,101.6 95.25,106.68 v96.52,106.68 | v88.9,106.68 87.63,106.68 82.55,105.41 72.39,105.41 69.85,107.95 69.85,111.76 67.31,114.3 E20.3
N$28
  Bottom 0.406: E6.2 113.03,13.97 116.84,17.78 116.84,87.63 113.03,91.44 E18.5
N$29
  Bottom 0.406: E18.9 105.41,93.98 107.95,91.44 107.95,85.09 110.49,82.55 113.03,82.55 113.03,77.47 110.49,77.47 109.22,76.2 109.22,41.91 107.95,39.37 107.95,35.56 102.87,29.21 102.87,16.51 E6.12
N$30
  Bottom 0.406: E17.5 95.25,91.44 93.98,90.17 93.98,77.47 91.44,68.58 91.44,62.23 92.71,57.15 92.71,33.02 90.17,30.48 88.9,30.48 86.36,27.94 86.36,21.59 87.63,20.32 90.17,20.32 95.25,13.97 E5.2
N$31
  Bottom 0.406: E17.9 90.17,93.98 92.71,91.44 92.71,77.47 90.17,68.58 90.17,62.23 91.44,57.15 91.44,33.02 90.17,31.75 88.9,31.75 85.09,27.94 85.09,19.05 87.63,16.51 E5.12
N$32
  Bottom 0.406: E4.2 82.55,13.97 83.82,15.24 83.82,31.75 85.09,35.56 85.09,88.9 82.55,91.44 E16.5
N$33
  Bottom 0.406: E4.12 72.39,16.51 72.39,27.94 77.47,33.02 77.47,50.8 80.01,53.34 80.01,77.47 82.55,77.47 82.55,82.55 78.74,82.55 77.47,83.82 77.47,91.44 74.93,93.98 E16.9
N$34
  Bottom 0.406: E3.2 64.77,13.97 59.69,17.78 57.15,17.78 57.15,27.94 62.23,33.02 62.23,67.31 63.5,73.66 63.5,90.17 64.77,91.44 E15.5
N$35
  Bottom 0.406: E3.12 57.15,16.51 55.88,17.78 55.88,27.94 60.96,33.02 60.96,67.31 62.23,73.66 62.23,92.71 60.96,93.98 E15.9
N$36
  Bottom 0.406: E2.2 52.07,13.97 53.34,15.24 53.34,31.75 54.61,34.29 54.61,87.63 53.34,90.17 52.07,91.44 E14.5
N$37
  Bottom 0.406: E2.12 41.91,16.51 40.64,19.05 40.64,26.67 45.72,33.02 45.72,62.23 52.07,73.66 52.07,82.55 49.53,82.55 46.99,85.09 46.99,92.71 45.72,93.98 E14.9
N$38
  Bottom 0.406: E1.2 34.29,13.97 29.21,17.78 26.67,17.78 26.67,27.94 33.02,34.29 33.02,44.45 31.75,45.72 31.75,58.42 33.02,64.77 33.02,90.17 34.29,91.44 E13.5
N$39
  Bottom 0.406: E1.12 26.67,16.51 25.4,17.78 25.4,29.21 31.75,35.56 31.75,44.45 30.48,45.72 30.48,58.42 31.75,64.77 31.75,92.71 30.48,93.98 E13.9
N$40
  Top 0.406: E13.12 E13.3
  Bottom 0.406: E13.12 26.67,86.36 25.4,87.63 25.4,95.25 26.67,96.52 E13.8
N$41
  Top 0.406: E13.2 36.83,83.82 41.91,88.9 E14.11
  Bottom 0.406: E13.2 36.83,83.82 38.1,85.09 38.1,92.71 36.83,93.98 E13.6
N$42
  Top 0.406: E14.12 E14.3
  Bottom 0.406: E14.8 41.91,96.52 40.64,95.25 40.64,87.63 41.91,86.36 E14.12
N$43
  Top 0.406: E14.2 52.07,83.82 57.15,88.9 E15.11
  Bottom 0.406: E14.2 49.53,83.82 48.26,85.09 48.26,92.71 49.53,93.98 E14.6
N$44
  Top 0.406: E15.12 E15.3
  Bottom 0.406: E15.12 57.15,86.36 55.88,87.63 55.88,95.25 57.15,96.52 E15.8
N$45
  Top 0.406: E15.2 67.31,83.82 72.39,88.9 E16.11
  Bottom 0.406: E15.6 67.31,93.98 67.31,83.82 E15.2
N$46
  Top 0.406: E16.12 E16.3
  Bottom 0.406: E16.12 72.39,86.36 71.12,87.63 71.12,95.25 72.39,96.52 E16.8
N$47
  Top 0.406: E16.2 82.55,83.82 87.63,88.9 E17.11
  Bottom 0.406: E16.2 80.01,83.82 78.74,85.09 78.74,92.71 80.01,93.98 E16.6
N$48
  Top 0.406: E17.12 E17.3
  Bottom 0.406: E17.12 87.63,86.36 86.36,87.63 86.36,95.25 87.63,96.52 E17.8
N$49
  Top 0.406: E17.2 97.79,83.82 102.87,88.9 E18.11
  Bottom 0.406: E17.2 97.79,83.82 99.06,85.09 99.06,92.71 97.79,93.98 E17.6
N$50
  Top 0.406: E18.12 E18.3
  Bottom 0.406: E18.8 102.87,96.52 101.6,95.25 101.6,87.63 102.87,86.36 E18.12
N$51
  Bottom 0.406: E23.3 110.49,114.3 109.22,113.03 109.22,95.25 110.49,93.98 | E18.6 110.49,93.98 | 110.49,93.98 109.22,92.71 109.22,85.09 110.49,83.82 E18.2
N$52
  Top 0.406: E23.2 113.03,111.76 114.3,113.03 114.3,120.65 113.03,121.92 E23.6
N$53
  Bottom 0.406: E7.6 34.29,53.34 34.29,58.42 41.91,71.12 41.91,82.55 44.45,82.55 49.53,81.28 E14.1
N$54
  Bottom 0.406: E7.3 34.29,44.45 33.02,45.72 33.02,58.42 40.64,71.12 40.64,82.55 41.91,83.82 E14.13
N$55  (via drill 0.81)
  Top 0.406: v27.94,78.74 29.21,78.74 34.29,81.28 E13.1
  Bottom 0.406: E7.8 27.94,58.42 29.21,64.77 29.21,78.74 v27.94,78.74
N$56
  Bottom 0.406: E7.11 29.21,46.99 29.21,58.42 30.48,64.77 30.48,82.55 29.21,83.82 E13.13
N$57
  Top 0.406: E9.2 64.77,41.91 59.69,44.45 E9.12 57.15,44.45 52.07,43.18 41.91,43.18 36.83,41.91 E7.2 34.29,41.91 29.21,44.45 E7.12 | E7.10 29.21,49.53 34.29,46.99 E7.4
  Bottom 0.406: E7.10 26.67,49.53 26.67,80.01 29.21,80.01 29.21,82.55 25.4,82.55 24.13,83.82 24.13,96.52 28.89,101.28 91.12,101.28 92.71,102.87 92.71,111.76 95.25,114.3 E22.3 | E9.10 57.15,49.53 57.15,44.45 E9.12 | E7.4 36.83,46.99 36.83,41.91 E7.2
N$58
  Top 0.406: E11.2 95.25,41.91 90.17,44.45 E11.12 87.63,44.45 82.55,43.18 72.39,43.18 67.31,46.99 E9.4 | E11.10 90.17,49.53 95.25,46.99 E11.4
  Bottom 0.406: E23.8 105.41,124.46 106.68,123.19 106.68,121.92 105.41,120.65 102.87,120.65 100.33,118.11 100.33,80.01 97.79,77.47 95.25,77.47 92.71,68.58 92.71,62.23 93.98,57.15 93.98,48.26 95.25,46.99 | 95.25,46.99 E11.4 | E11.2 95.25,41.91 93.98,43.18 93.98,45.72 95.25,46.99
N$59
  Top 0.406: E22.10 90.17,119.38 95.25,121.92 E22.6
N$60
  Top 0.406: U$2.AP1 8.89,41.91 15.24,41.91 19.05,40.64 21.59,40.64 26.67,41.91 E7.13
N$61
  Bottom 0.406: E16.1 80.01,81.28 74.93,80.01 72.39,80.01 71.12,78.74 71.12,76.2 64.77,63.5 64.77,52.07 E9.6
N$62
  Bottom 0.406: E16.13 72.39,83.82 69.85,81.28 69.85,76.2 63.5,63.5 63.5,45.72 64.77,44.45 E9.3
N$63  (via drill 0.81)
  Top 0.406: E15.1 64.77,81.28 59.69,78.74 v58.42,78.74
  Bottom 0.406: E9.8 58.42,67.31 59.69,73.66 59.69,78.74 v58.42,78.74
N$64
  Bottom 0.406: E9.11 59.69,46.99 59.69,67.31 60.96,73.66 60.96,82.55 59.69,83.82 E15.13
N$65
  Bottom 0.406: E17.13 90.17,83.82 91.44,82.55 91.44,77.47 88.9,68.58 88.9,62.23 90.17,57.15 90.17,46.99 E11.11
N$66  (via drill 0.81)
  Top 0.406: v88.9,78.74 90.17,78.74 95.25,81.28 E17.1
  Bottom 0.406: E11.8 87.63,54.61 87.63,78.74 v88.9,78.74
N$67
  Bottom 0.406: E18.13 102.87,83.82 101.6,82.55 101.6,58.42 97.79,52.07 E11.6
N$68
  Bottom 0.406: E11.3 97.79,44.45 100.33,46.99 100.33,52.07 102.87,58.42 102.87,82.55 105.41,82.55 110.49,81.28 E18.1
N$69  (via drill 0.81)
  Top 0.406: v20.32,44.45 21.91,44.45 24.13,46.67 26.04,51.44 26.67,52.07 E7.9
  Bottom 0.406: U$2.AR2 10.16,45.72 13.97,45.72 v20.32,44.45
N$70  (via drill 0.81)
  Top 0.406: v20.32,39.37 21.59,39.37 26.67,40.64 29.21,40.64 34.29,39.37 E7.1
  Bottom 0.406: U$2.AN2 8.89,39.37 v20.32,39.37
N$71
  Top 0.406: U$2.AR1 8.89,45.72 15.24,45.72 19.05,43.18 21.91,43.18 25.4,46.67 26.67,49.53 26.67,50.8 29.21,50.8 34.29,49.53 E7.5
N$72
  Top 0.406: U$2.AL1 7.62,33.02 52.07,33.02 54.61,35.56 54.61,40.64 55.88,41.91 E9.13
N$73
  Top 0.406: U$2.AK1 8.89,29.21 21.59,29.21 26.67,31.75 59.69,31.75 62.23,34.29 62.23,36.83 64.77,39.37 E9.1
N$74  (via drill 0.81)
  Top 0.406: v20.32,49.53 21.59,49.53 25.4,58.42 29.21,58.42 34.29,55.88 52.07,55.88 57.15,52.07 E9.9
  Bottom 0.406: U$2.AT2 8.89,52.07 13.97,52.07 v20.32,49.53
N$75
  Top 0.406: U$2.AV1 8.89,58.42 19.05,58.42 25.4,63.5 29.21,63.5 34.29,60.96 82.55,60.96 85.09,58.42 85.09,54.61 87.63,52.07 E11.9
N$76
  Top 0.406: U$2.AH1 8.89,22.86 13.97,22.86 19.05,25.4 21.59,25.4 26.67,27.94 82.55,27.94 85.09,30.48 85.09,39.37 87.63,41.91 E11.13
N$77  (via drill 0.81)
  Top 0.406: v20.32,52.07 21.59,52.07 24.13,58.42 25.4,59.69 29.21,59.69 34.29,57.15 59.69,57.15 64.77,49.53 E9.5
  Bottom 0.406: U$2.AU2 10.16,54.61 13.97,54.61 v20.32,52.07
N$78
  Top 0.406: U$2.AE1 8.89,16.51 13.97,16.51 16.51,19.05 16.51,20.32 19.05,22.86 90.17,22.86 93.98,26.67 93.98,38.1 95.25,39.37 E11.1
N$79
  Top 0.406: U$2.BA1 8.89,73.66 16.51,73.66 25.4,64.77 29.21,64.77 34.29,62.23 90.17,62.23 92.71,59.69 92.71,52.07 95.25,49.53 E11.5
N$80  (via drill 0.81)
  other vias: 96.52,8.89
N$81
  Top 0.406: E21.12 74.93,114.3 80.01,115.57 82.55,115.57 87.63,121.92 E22.9 90.17,121.92 95.25,125.73 99.06,125.73 102.87,119.38 E23.10
N$82  (via drill 0.81)
  other vias: 20.32,34.29
N$83
  Top 0.406: E21.3 E22.12
  Bottom 0.406: E22.13 E22.12 87.63,114.3 86.36,115.57 86.36,123.19 87.63,124.46 E22.8
N$84
  Bottom 0.406: E20.9 E20.10 57.15,119.38 52.07,111.76 D1.C R2.2 49.53,109.22 44.45,106.68 C26.2
N$85
  Top 0.406: E21.6 80.01,121.92 74.93,118.11 72.39,118.11 67.31,115.57 64.77,115.57 59.69,111.76 E20.13
N$86
  Top 0.406: R3.2 34.29,116.84 29.21,115.57 26.67,115.57 21.59,114.3 E19.12
  Bottom 0.406: R3.2 36.83,116.84 41.91,114.3 C27.2 | E19.13 E19.12 E19.11 E19.10 E19.9
N$87
  Bottom 0.406: R1.1 C26.1 52.07,106.68 57.15,116.84 E20.11
N$88  (via drill 0.81)
  other vias: 35.56,114.3
N$89
  Bottom 0.406: R3.1 52.07,116.84 57.15,124.46 E20.8 59.69,124.46 60.96,123.19 60.96,115.57 59.69,114.3 E20.12
N$90  (via drill 0.81)
  other vias: 35.56,119.38
N$91  (via drill 0.81)
  other vias: 35.56,78.74
N$92  (via drill 0.81)
  other vias: 35.56,124.46
N$93  (via drill 0.81)
  other vias: 20.32,83.82
N$94  (via drill 0.81)
  other vias: 35.56,106.68
N$95  (via drill 0.81)
  other vias: 43.18,109.22
N$96  (via drill 0.81)
  other vias: 43.18,111.76
N$97  (via drill 0.81)
  other vias: 43.18,104.14
N$98  (via drill 0.81)
  other vias: 43.18,116.84
N$99  (via drill 0.81)
  other vias: 43.18,121.92
N$100  (via drill 0.81)
  other vias: 43.18,124.46
N$101  (via drill 0.81)
  other vias: 50.8,121.92
N$102  (via drill 0.81)
  other vias: 50.8,119.38
N$103  (via drill 0.81)
  other vias: 35.56,36.83
N$104  (via drill 0.81)
  other vias: 66.04,36.83
N$105  (via drill 0.81)
  other vias: 111.76,106.68
N$106  (via drill 0.81)
  other vias: 66.04,106.68
N$107  (via drill 0.81)
  other vias: 96.52,36.83
N$108  (via drill 0.81)
  other vias: 35.56,8.89
N$109  (via drill 0.81)
  other vias: 20.32,86.36
N$111  (via drill 0.81)
  other vias: 104.14,78.74
OVERFLOW
  Top 0.406: U$2.BS1 8.89,118.11 13.97,118.11 19.05,123.19 83.82,123.19 87.63,127 97.79,127 102.87,125.73 105.41,125.73 110.49,119.38 E23.5
SET_COUNT  (via drill 0.81)
  Top 0.406: E19.6 v35.56,121.92 | E18.4 110.49,88.9 105.41,91.44 E18.10 102.87,91.44 97.79,88.9 E17.4 95.25,88.9 90.17,91.44 E17.10 87.63,91.44 82.55,88.9 E16.4 80.01,88.9 74.93,91.44 E16.10 72.39,91.44 67.31,88.9 E15.4 64.77,88.9 59.69,91.44 E15.10 57.15,91.44 52.07,88.9 E14.4 49.53,88.9 44.45,91.44 E14.10 | E13.4 34.29,88.9 29.21,91.44 E13.10 26.67,91.44 21.59,88.9 v20.32,88.9 19.05,88.9 15.24,92.71 8.89,92.71 U$2.BH1
  Bottom 0.406: E19.6 26.67,121.92 22.86,118.11 22.86,90.17 21.59,88.9 v20.32,88.9 | E23.13 105.41,111.76 | 105.41,111.76 106.68,110.49 106.68,96.52 105.41,95.25 102.87,95.25 102.87,91.44 E18.10 | 105.41,111.76 107.95,114.3 107.95,118.11 110.49,120.65 113.03,120.65 114.3,121.92 114.3,125.73 113.03,127 95.25,127 90.17,128.27 85.09,128.27 81.28,125.73 72.39,125.73 67.31,120.65 64.77,120.65 63.5,121.92 63.5,125.09 60.33,128.27 57.15,128.27 52.07,125.73 49.53,125.73 44.45,119.38 v43.18,119.38 41.91,119.38 36.83,121.92 v35.56,121.92
TRANSFER  (via drill 0.81)
  Top 0.406: E6.3 110.49,16.51 105.41,19.05 E6.11 102.87,19.05 97.79,16.51 E5.3 95.25,16.51 90.17,19.05 E5.11 87.63,19.05 82.55,16.51 E4.3 80.01,16.51 74.93,19.05 E4.11 72.39,19.05 67.31,16.51 E3.3 64.77,16.51 59.69,19.05 E3.11 57.15,19.05 52.07,16.51 E2.3 49.53,16.51 44.45,19.05 E2.11 41.91,19.05 36.83,16.51 E1.3 34.29,16.51 29.21,19.05 E1.11 26.67,19.05 21.59,16.51 v20.32,16.51
  Bottom 0.406: U$2.AE2 10.16,16.51 v20.32,16.51 21.59,16.51 22.86,17.78 22.86,86.36 21.59,87.63 19.05,87.63 19.05,90.17 21.59,90.17 21.59,124.46 E19.8 | E5.11 87.63,19.05
VCC  (via drill 0.81)
  Top 0.813: E13.14 26.67,81.28 21.59,76.2 C25.+ C13.1 29.21,76.2 31.75,73.66 36.83,73.66 41.91,76.2 C14.1 | 110.49,78.74 105.41,81.28 E18.14 102.87,81.28 97.79,78.74 v96.52,78.74 95.25,78.74 90.17,76.2 C17.1 87.63,76.2 82.55,78.74 | 110.49,78.74 105.41,76.2 | 105.41,76.2 C18.1 | 110.49,78.74 v111.76,78.74 | R1.2 34.29,104.14 29.21,106.68 v27.94,106.68 26.67,106.68 21.59,104.14 C19.1 19.05,104.14 17.78,105.41 17.78,107.95 19.05,109.22 E19.14 | 52.07,78.74 57.15,76.2 C15.1 59.69,76.2 64.77,78.74 v66.04,78.74 67.31,78.74 72.39,81.28 E16.14 74.93,81.28 80.01,78.74 | 52.07,78.74 v50.8,78.74 49.53,78.74 44.45,81.28 E14.14 | E15.14 57.15,81.28 52.07,78.74 | 80.01,78.74 v81.28,78.74 82.55,78.74 | C16.1 74.93,76.2 80.01,78.74 | E17.14 87.63,81.28 82.55,78.74 | 105.41,76.2 110.49,73.66 113.03,73.66 115.57,76.2 115.57,99.06 113.03,101.6 110.49,101.6 105.41,104.14 C23.1 102.87,104.14 97.79,101.6 95.25,101.6 90.17,104.14 C22.1 | v73.66,106.68 C21.1 | C27.1 52.07,114.3 57.15,109.22 E20.14
  Bottom 0.813: U$2.AA2 8.89,4.13 8.89,3.81 20.32,3.81 | C24.+ 20.32,3.81 | 20.32,3.81 27.94,3.81 | 27.94,3.81 43.18,3.81 | 43.18,3.81 58.42,3.81 | 58.42,3.81 73.66,3.81 | 73.66,3.81 88.9,3.81 | 88.9,3.81 102.87,3.81 104.14,5.08 C6.1 v104.14,8.89 | 27.94,3.81 C1.1 v27.94,8.89 E1.14 26.67,11.43 24.13,13.97 24.13,30.48 C7.1 v27.94,36.83 E7.14 26.67,39.37 25.4,40.64 25.4,80.64 26.04,81.28 E13.14 | 43.18,3.81 C2.1 v43.18,8.89 | 58.42,3.81 C3.1 v58.42,8.89 | 73.66,3.81 C4.1 v73.66,8.89 | 88.9,3.81 C5.1 v88.9,8.89 E5.14 | v43.18,8.89 E2.14 | v58.42,8.89 E3.14 | v73.66,8.89 E4.14 | v104.14,8.89 E6.14 | v43.18,8.89 41.91,8.89 39.37,11.43 39.37,26.67 C8.1 v43.18,36.83 E8.14 | U$2.BA2 10.16,73.66 15.24,73.66 C25.+ | R1.2 36.83,104.14 38.42,102.55 58.42,102.55 | 58.42,102.55 C20.1 v58.42,106.68 E20.14 | 58.42,102.55 73.66,102.55 | 73.66,102.55 C21.1 | E21.14 v73.66,106.68 | 73.66,102.55 88.9,102.55 C22.1 90.17,104.14 91.44,105.41 91.44,107.95 90.17,109.22 E22.14 | C23.1 v104.14,106.68 E23.14 | v111.76,78.74 109.22,78.74 107.95,77.47 107.95,41.91 106.68,39.37 E12.14 v104.14,36.83 C12.1 101.6,30.48 101.6,10.16 102.87,8.89 v104.14,8.89 | C11.1 v88.9,36.83 | v88.9,36.83 87.63,36.83 86.36,38.1 86.36,80.01 87.63,81.28 E17.14 | v73.66,8.89 72.39,8.89 71.12,10.16 71.12,30.48 C10.1 v73.66,36.83 E10.14 | E9.14 v58.42,36.83 | v58.42,36.83 C9.1 54.61,29.21 54.61,11.43 57.15,8.89 v58.42,8.89 | E11.14 v88.9,36.83 | C14.1 44.45,76.2 49.53,78.74 v50.8,78.74 | v58.42,36.83 57.15,36.83 55.88,38.1 55.88,64.77 57.15,76.2 C15.1

### Text on the board
Bottom: CLOCK COUNTER M709B